# EAGLE design SideSensor_PCB_v6 (EAGLE 9.7.0)
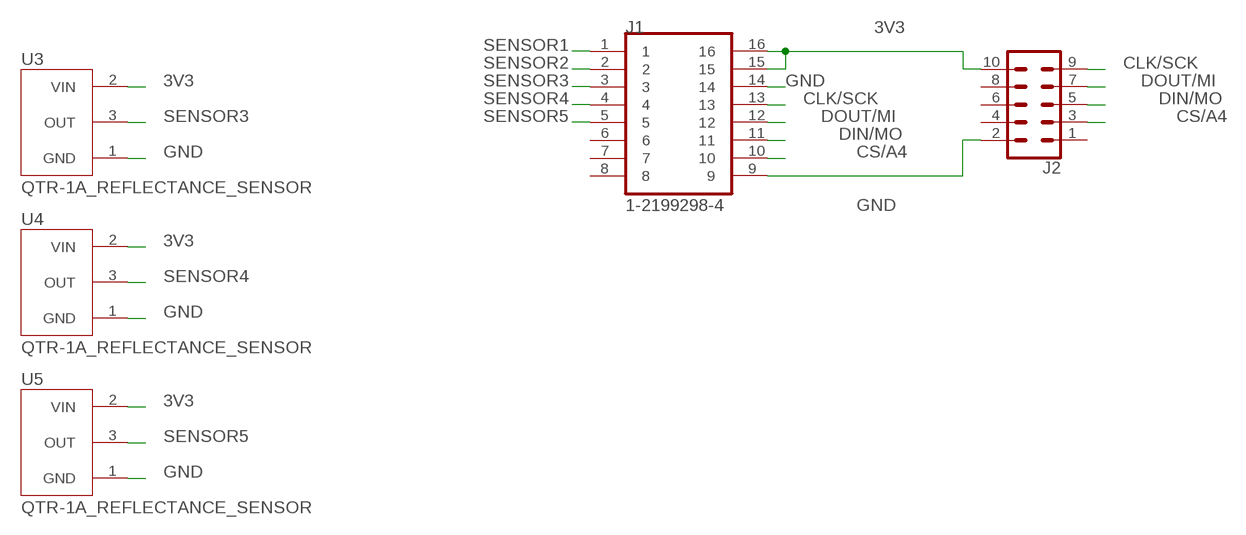
[diagram p0: schematic, sheet 1]

## Parts
J1  1-2199298-4  [TE_1-2199298-4]
J2  CONN_05X2SHD  [2X5-SHROUDED]
U3  QTR-1A_REFLECTANCE_SENSOR  [SENSOR_QTR-1A_REFLECTANCE_SENSOR]
U4  QTR-1A_REFLECTANCE_SENSOR  [SENSOR_QTR-1A_REFLECTANCE_SENSOR]
U5  QTR-1A_REFLECTANCE_SENSOR  [SENSOR_QTR-1A_REFLECTANCE_SENSOR]

## Nets
3V3: J1.15 J1.16 J2.10 U3.2(VIN) U4.2(VIN) U5.2(VIN)
CLK/SCK: J1.13 J2.9
CS/A4: J1.10 J2.3
DIN/MO: J1.11 J2.5
DOUT/MI: J1.12 J2.7
GND: J1.9 J1.14 J2.2 U3.1(GND) U4.1(GND) U5.1(GND)
SENSOR1: J1.1
SENSOR2: J1.2
SENSOR3: J1.3 U3.3(OUT)
SENSOR4: J1.4 U4.3(OUT)
SENSOR5: J1.5 U5.3(OUT)
Unconnected: J1.6 J1.7 J1.8 J2.1 J2.4 J2.6 J2.8

## Library data of the parts
J1 = 16 pin IC Socket:1-2199298-4; MANUFACTURER: TE; PARTREV: A; STANDARD: Manufacturer Recommendations
J2 = SparkFun-Connectors:CONN_05X2: Multi connection point. Often used as Generic Header-pin footprint for 0.1 inch spaced/style header connections For AVR SPI programming port, see special device with nice symbol: "AVR_SPI_PROG_5x2.dev" You can populate with any combo of single row headers, but if you'd like an exact match, check these: 2x5 AVR ICSP Male Header <https://www.sparkfun.com/products/778> (PRT-00778) 2x5 Pin Shrouded Header <https://www.sparkfun.com/products/8506> (PRT-08506) On any of the 0.1 inch spaced packages, you can populate with these: Break Away Headers - Straight <https://www.sparkfun.com/products/116> (PRT-00116) Break Away Male Headers - Right Angle <https://www.sparkfun.com/products/553> (PRT-00553) Female Headers <https://www.sparkfun.com/products/115> (PRT-00115) Break Away Headers - Machine Pin <https://www.sparkfun.com/products/117> (PRT-00117) Break Away Female Headers - Swiss Machine Pin <https://www.sparkfun.com/products/743> (PRT-00743) Special note: the shrouded connector mates well with our 5x2 ribbon cables: 2x5 Pin IDC Ribbon Cable <https://www.sparkfun.com/products/8535> (PRT-08535); PROD_ID: CONN-08671; SF_ID: PRT-08506
U3-U5 = QTR-1A_REFLECTANCE_SENSOR:QTR-1A_REFLECTANCE_SENSOR: Check availability <https://pricing.snapeda.com/parts/QTR-1A%20REFLECTANCE%20SENSOR/Pololu/view-part?ref=eda>; AVAILABILITY: Not in stock; CHECK_PRICES: https://www.snapeda.com/parts/QTR-1A%20REFLECTANCE%20SENSOR/Pololu/view-part/?ref=eda; DESCRIPTION: QTR-1A series Phototransistor Sensor Evaluation Board; MF: Pololu; MP: QTR-1A REFLECTANCE SENSOR; PACKAGE: None; PRICE: None; SNAPEDA_LINK: https://www.snapeda.com/parts/QTR-1A%20REFLECTANCE%20SENSOR/Pololu/view-part/?ref=snap

## Board
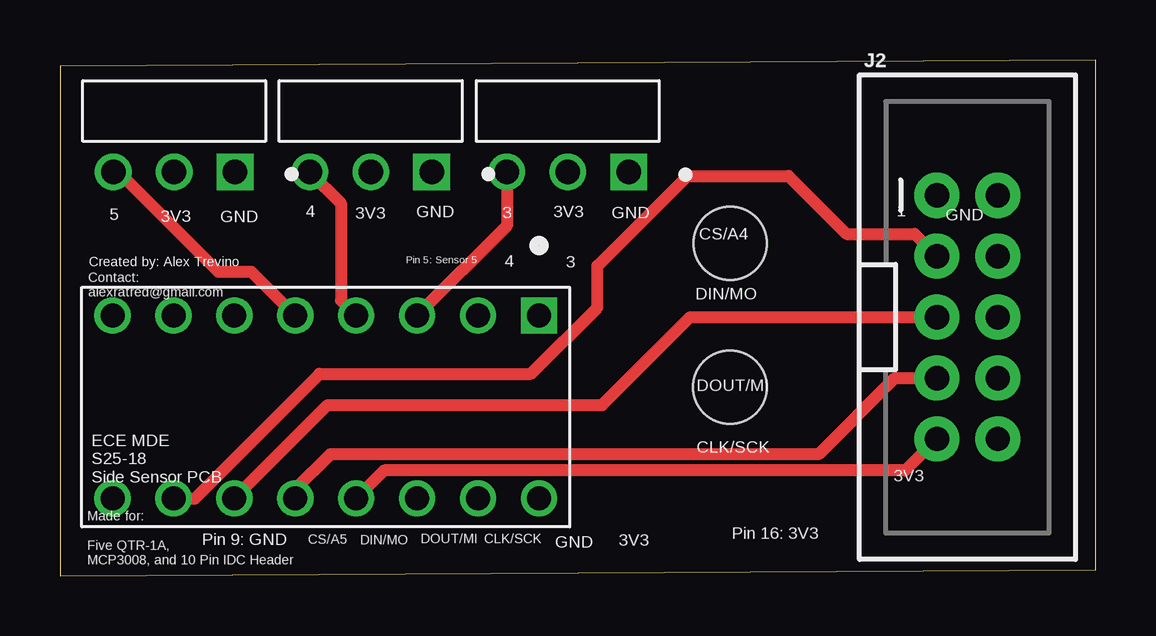
[diagram p1: board, top side]
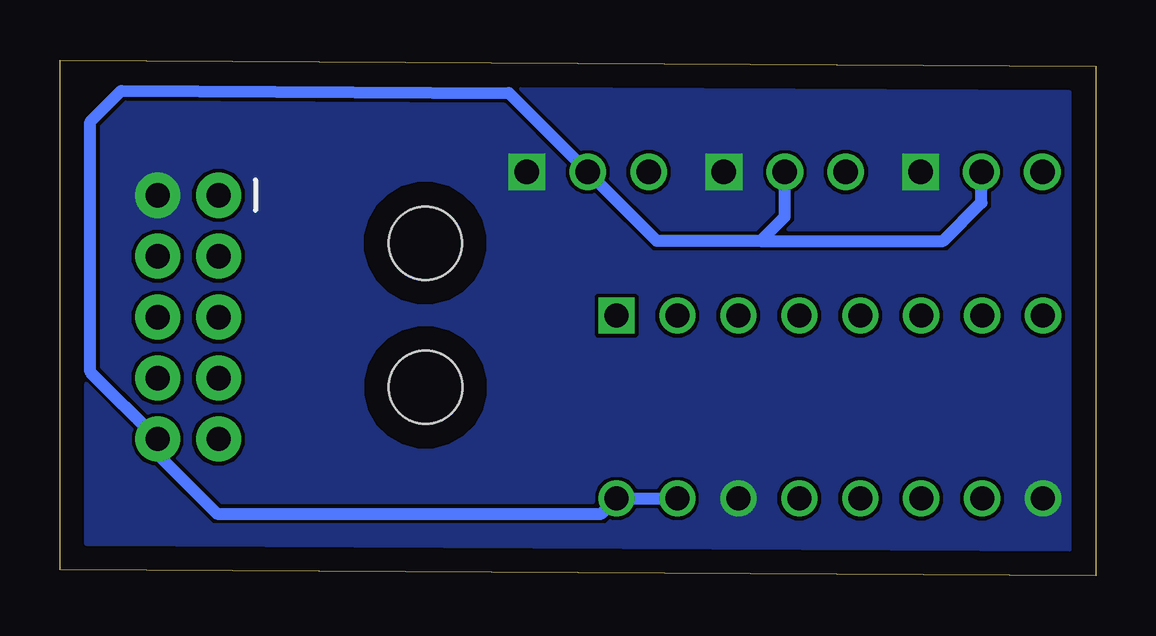
[diagram p2: board, bottom side, seen from below]

Size 43.17 x 21.52 mm. Coordinates in mm from the lower left corner, seen from the top.
Outline: 0,0 43.17,0.26 43.17,21.52 0,21.26 0,0
Copper layers (1*16): Top / Bottom
Stack-up Default Layer Stack: Top User Defined 0.035mm / Dielectric-1 User Defined 1.5mm / Bottom User Defined 0.035mm
Design rules: minimum copper width 6mil, minimum drill size 0.35mm, copper clearance wire_polygon to wire_polygon 6mil, copper clearance wire_polygon to pad_smd 6mil, copper clearance wire_polygon to via 6mil, copper clearance pad_smd to pad_smd 6mil, copper clearance pad_smd to via 6mil, copper clearance via to via 6mil, copper clearance smd to pad (same net) 6mil, copper clearance smd to via (same net) 6mil, copper clearance smd to smd (same net) 6mil, dimension clearance 40mil, via restrict clearance 0mil, restrict clearance 0mil, drill distance 6mil, keepout clearance 0mil
Holes 3.05 mm at 27.94,13.88 27.93,7.87

### Footprints (pad centres in the part's own frame; a part is rotated, then mirrored left to right if it is on the bottom)
TE_1-2199298-4 = drill 1 square: 1 -3.81,8.89 | drill 1: 2 -3.81,6.35; 3 -3.81,3.81; 4 -3.81,1.27; 5 -3.81,-1.27; 6 -3.81,-3.81; 7 -3.81,-6.35; 8 -3.81,-8.89; 9 3.81,-8.89; 10 3.81,-6.35; 11 3.81,-3.81; 12 3.81,-1.27; 13 3.81,1.27; 14 3.81,3.81; 15 3.81,6.35; 16 3.81,8.89
2X5-SHROUDED = drill 1.016 pad 1.88: 1 -1.27,5.08; 2 1.27,5.08; 3 -1.27,2.54; 4 1.27,2.54; 5 -1.27,0; 6 1.27,0; 7 -1.27,-2.54; 8 1.27,-2.54; 9 -1.27,-5.08; 10 1.27,-5.08
SENSOR_QTR-1A_REFLECTANCE_SENSOR = drill 1.02 square: 1 -2.54,2.54 | drill 1.02: 2 0,2.54; 3 2.54,2.54

### Placement (x,y rotation side)
J1  11.08,7.05 270 top
J2  37.83,10.79 0 top
U3  21.17,19.39 180 top
U4  12.95,19.39 180 top
U5  4.76,19.39 180 top

### Tracks (layer width: path | path; a pad name or v marks a point on that pad's centre or on a via)
3V3
  Bottom 0.508: 13.97,13.97 12.95,14.99 U4.2 | 13.97,13.97 6.35,13.97 4.76,15.56 U5.2 | J1.15 J1.16 20.61,2.6 36.62,2.6 39.1,5.08 J2.10 41.9,8.52 41.9,18.94 40.61,20.23 24.46,20.14 U3.2 18.29,13.97 13.97,13.97
CLK/SCK
  Top 0.508: J2.9 35.24,4.4 13.51,4.4 J1.13
CS/A4
  Top 0.508: J1.10 5.63,3.24 10.82,8.43 19.62,8.43 22.4,11.2 22.4,12.93 26.15,16.68 30.37,16.68 32.78,14.26 35.63,14.26 J2.3
DIN/MO
  Top 0.508: J1.11 11.16,7.13 22.6,7.13 26.27,10.79 J2.5
DOUT/MI
  Top 0.508: J2.7 34.8,8.25 31.62,5.07 11.28,5.07 9.81,3.61 J1.12
GND
  pour Bottom (no thermals): -2.46,21.17 42.92,21.17 42.92,-0.59 -0.65,-0.59 -2.98,20.66
SENSOR3
  Top 0.508: U3.3 18.63,14.6 J1.3
SENSOR4
  Top 0.508: U4.3 11.71,15.55 11.71,11.49 J1.4
SENSOR5
  Top 0.508: U5.3 2.44,16.85 6.6,12.69 7.97,12.69 J1.5

### Text on the board
SilkscreenTop: 5 | 3V3 | GND | 4 | 3V3 | GND | 3 | 3V3 | GND | 1 | GND | CS/A4 | Created by: Alex Trevino | Pin 5: Sensor 5 | 4 | 3 | Contact: / alexratred@gmail.com | DIN/MO | DOUT/MI | CLK/SCK | ECE MDE / S25-18 / Side Sensor PCB | 3V3 | Pin 9: GND | CS/A5 | DIN/MO | DOUT/MI | CLK/SCK | 3V3 | Pin 16: 3V3 | Made for: / / Five QTR-1A, / MCP3008, and 10 Pin IDC Header | GND